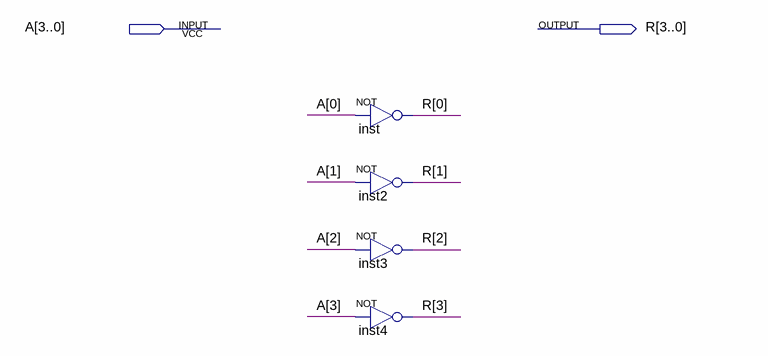
[diagram p0: schematic sheet]
// Quartus schematic TestingGrounds.bdf as structural Verilog: 4 symbols, 2 pins
module TestingGrounds (
  input  [3:0] A,
  output [3:0] R
);

  not inst (R[0], A[0]);
  not inst2 (R[1], A[1]);
  not inst3 (R[2], A[2]);
  not inst4 (R[3], A[3]);
endmodule
